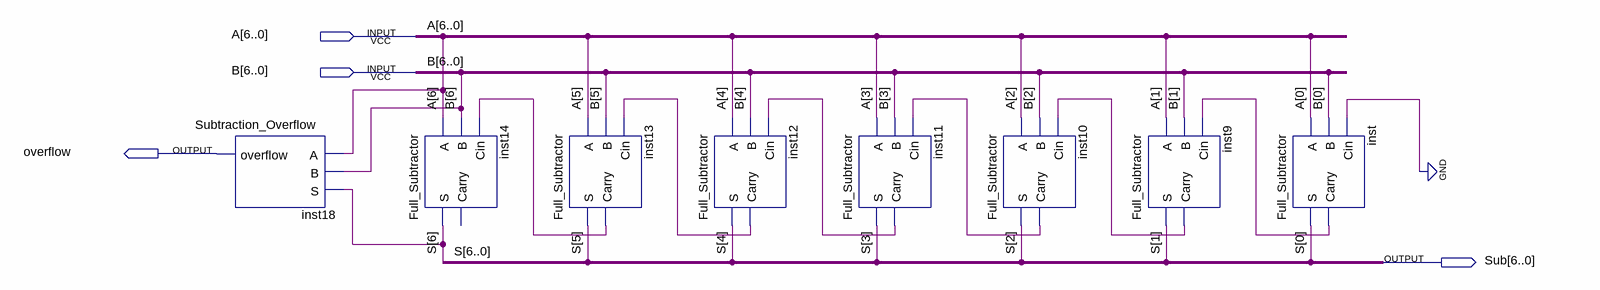
[diagram p0: schematic sheet]
// Quartus schematic Seven_bit_Subtractor.bdf as structural Verilog: 8 symbols, 4 pins
module Seven_bit_Subtractor (
  input  [6:0] A,
  input  [6:0] B,
  output overflow,
  output [6:0] Sub
);

  wire inst9_carry, inst10_carry, inst11_carry, inst12_carry, inst13_carry, inst_carry;

  Subtraction_Overflow inst18 (.A(A[6]), .B(B[6]), .S(Sub[6]), .overflow(overflow));
  Full_Subtractor inst14 (.A(A[6]), .B(B[6]), .Cin(inst13_carry), .S(Sub[6]));  // open: Carry
  Full_Subtractor inst13 (.A(A[5]), .B(B[5]), .Cin(inst12_carry), .S(Sub[5]), .Carry(inst13_carry));
  Full_Subtractor inst12 (.A(A[4]), .B(B[4]), .Cin(inst11_carry), .S(Sub[4]), .Carry(inst12_carry));
  Full_Subtractor inst11 (.A(A[3]), .B(B[3]), .Cin(inst10_carry), .S(Sub[3]), .Carry(inst11_carry));
  Full_Subtractor inst10 (.A(A[2]), .B(B[2]), .Cin(inst9_carry), .S(Sub[2]), .Carry(inst10_carry));
  Full_Subtractor inst9 (.A(A[1]), .B(B[1]), .Cin(inst_carry), .S(Sub[1]), .Carry(inst9_carry));
  Full_Subtractor inst (.A(A[0]), .B(B[0]), .Cin(1'b0), .S(Sub[0]), .Carry(inst_carry));

  // Other names for the same wires on the sheet: S[6:0] = Sub
endmodule
